# Altium schematic sheet power supply.SchDoc
size A3; SheetNumber: 1; SheetTotal: 2
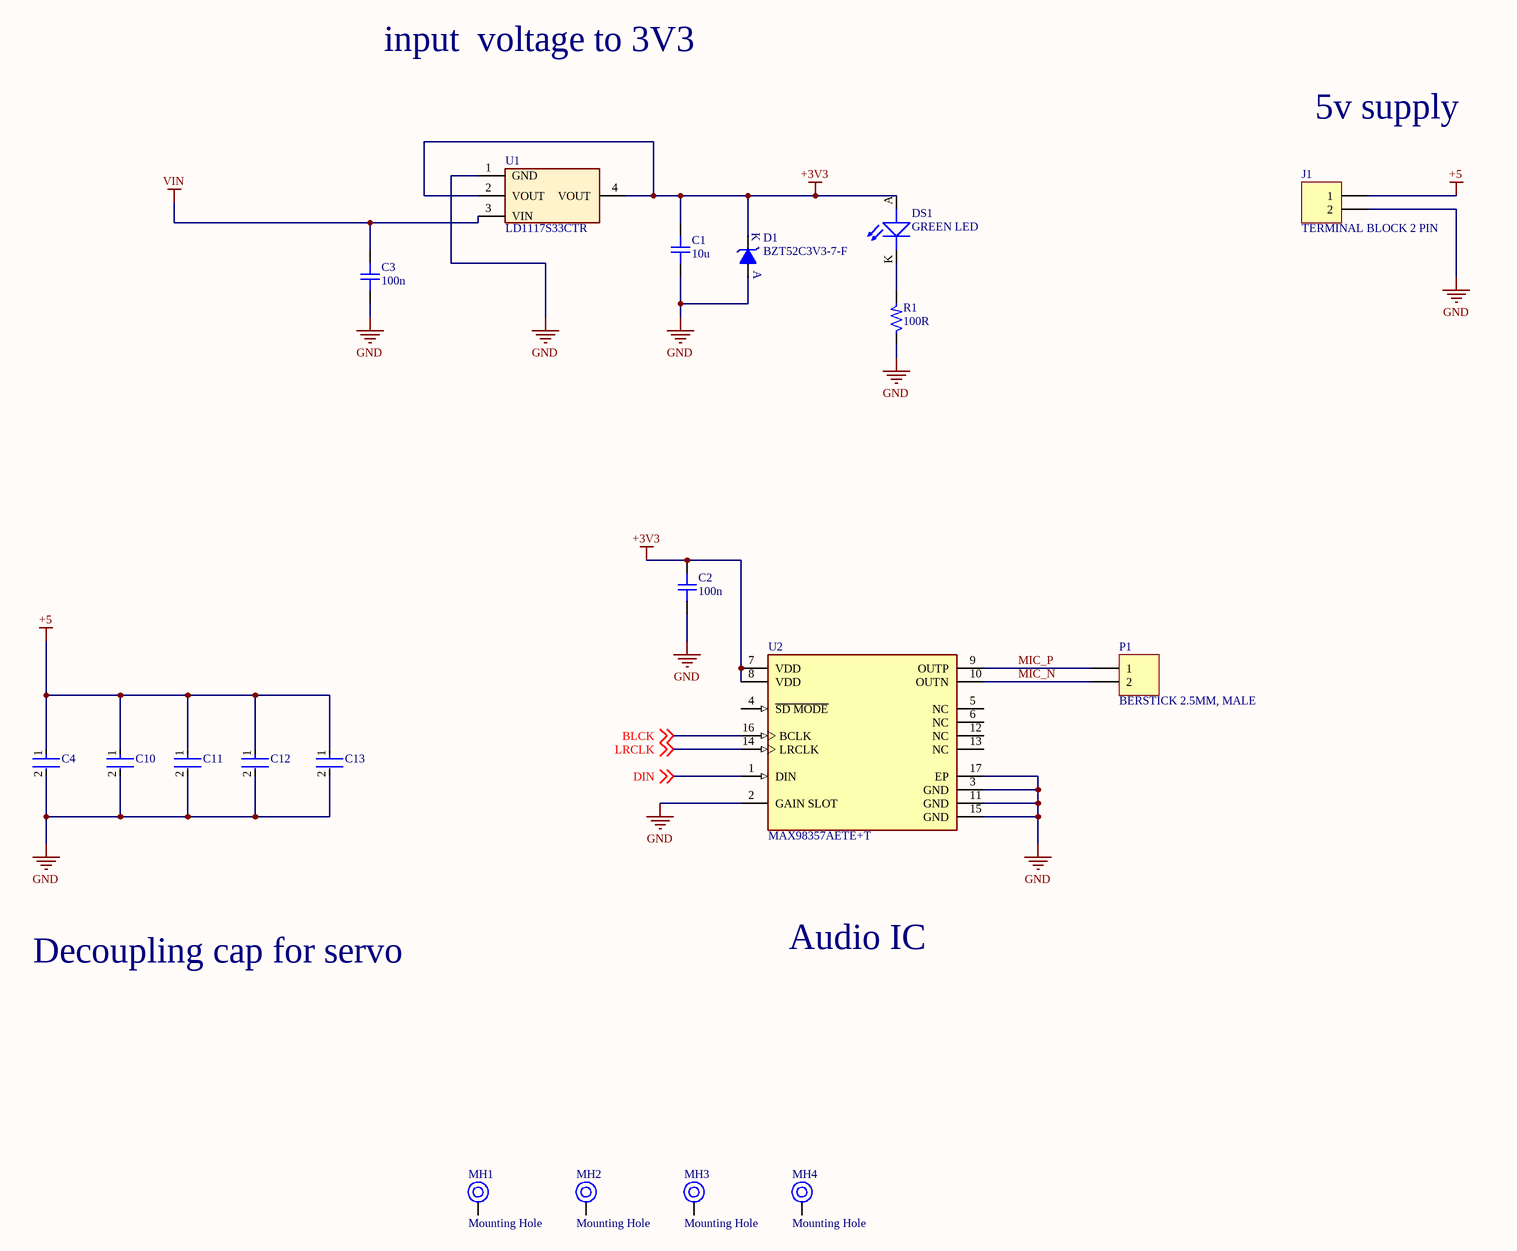
[diagram p0: power supply.SchDoc]

## Parts
C1  10u  [CAP_0603]
C2  100n  [CAP_0402]
C3  100n  [CAP_0402]
C4  C1210C107M9PACTU  [FP-C1210C107M9PACTU-MFG]  (value not drawn)
C10  C1210C107M9PACTU  [FP-C1210C107M9PACTU-MFG]  (value not drawn)
C11  C1210C107M9PACTU  [FP-C1210C107M9PACTU-MFG]  (value not drawn)
C12  C1210C107M9PACTU  [FP-C1210C107M9PACTU-MFG]  (value not drawn)
C13  C1210C107M9PACTU  [FP-C1210C107M9PACTU-MFG]  (value not drawn)
D1  BZT52C3V3-7-F  [DIO_SOD-123]
DS1  GREEN LED  [LED_0805]
J1  TERMINAL BLOCK 2 PIN  [CON2_P196_1729128_TH_ST]
MH1  Mounting Hole  [MOUNTING]
MH2  Mounting Hole  [MOUNTING]
MH3  Mounting Hole  [MOUNTING]
MH4  Mounting Hole  [MOUNTING]
P1  BERSTICK 2.5MM, MALE  [CON2_100_43D62_TH_ST]
R1  100R  [RES_0603]
U1  LD1117S33CTR  [SOT223_3]
U2  MAX98357AETE+T  [FP-T1633-4-MFG]

## Nets
+3V3: C1.2 C2.2 D1.K DS1.A(ANODE) U1.2(VOUT) U1.4(VOUT) U2.7(VDD) U2.8(VDD)
+5: C4.1 C10.1 C11.1 C12.1 C13.1 J1.1
GND: C1.1 C2.1 C3.1 C4.2 C10.2 C11.2 C12.2 C13.2 D1.A J1.2 R1.1 U1.1(GND) U2.2(GAIN_SLOT) U2.3(GND) U2.11(GND) U2.15(GND) U2.17(EP)
VIN: C3.2 U1.3(VIN)
BLCK: U2.16(BCLK) ; off-sheet BLCK
DIN: U2.1(DIN) ; off-sheet DIN
LRCLK: U2.14(LRCLK) ; off-sheet LRCLK
MIC_N: P1.2 U2.10(OUTN)
MIC_P: P1.1 U2.9(OUTP)
NetDS1_K: DS1.K(CATHODE) R1.2

Not connected (* = marked no-connect by the designer): MH1 1; MH2 1; MH3 1; MH4 1; U2 4(~{SD_MODE}) 5(NC) 6(NC) 12(NC) 13(NC)

## Notes on the sheet
- input  voltage to 3V3
- 5v supply
- Decoupling cap for servo
- Audio IC

## Library data of the parts
C1 = CAP_0603_10V: Capacitor SMD 0603 10V; Manufacturer: Samsung; Manufacturer Part Number: CL10A106KP8NNNC; LCSC: C19702
C2 C3 = CAP_0402_50V_1: Capacitor SMD 0402 50V; Manufacturer: Samsung; Manufacturer Part Number: CL05B104KO5NNNC; LCSC: C1525
C4 C10-C13 = CMP-2000-06018-2: CAP CER 100UF 6.3V X5R 1210; Dissipation Factor: 5%; Dielectric Material: Ceramic; Tolerance: 20%; Termination: SMD/SMT; REACH SVHC: No SVHC; Thickness: 0.11inch; Packaging: Tape and Reel; Series: C; Width: 2.5mm; Voltage Rating (DC): 6.3V; Voltage: 6.3V; Contact Plating: Tin; Package Quantity: 1; Case/Package: 1210; Min Operating Temperature: -55°C; Height: 2.5mm; Radiation Hardening: No; Capacitance: 100uF; Case Code (Metric): 3225; Depth: 2.5mm; Construction: Flat; Max Operating Temperature: 85°C; Number of Pins: 2; Mount: Surface Mount; Lead Free: Lead Free; RoHS Compliant: Yes; Voltage Rating: 6.3V; Dielectric: X5R; Length: 3.2mm; Case Code (Imperial): 1210
D1 = DIO-Z_3.3V-500mW-SOD123: Zener Diode 3.3V 500mW ±6% Surface Mount SOD-123; Manufacturer: Diodes Incorporated; Alternate Part Number-1: NA; Manufacturer Part Number: BZT52C3V3-7-F; Case/Package: SOD-123; Supplier-1: Digikey; Supplier Part Number-1: BZT52C3V3-FDICT-ND
DS1 = LED_GREEN-2.2-20mA-0805: Green 569nm LED Indication - Discrete 2.1V 0805 (2012 Metric); Manufacturer: Vishay Lite-On; Manufacturer Part Number: LTST-C171GKT; Alternate Part Number-1: NA; Case/Package: 0805; Supplier-1: SP ROAD; Supplier Part Number-1: LTST-C171GKT
J1 = CON-TB_2X1-196-ST-TH: 2 Pins, 1 Row 5mm Pitch, straight Connector, male; Manufacturer: Phoenix Contact; Manufacturer Part Number: MKDSN1,5/2; Alternate Part Number-1: NA; Case/Package: TH-CON; Supplier-1: SP ROAD; Supplier Part Number-1: MKDSN1,5/2
MH1-MH4 = MH_3.5H_6D: Manufacturer Part Number: NA; Case/Package: TH; Manufacturer: NA; Supplier-1: NA; Supplier Part Number-1: NA; Alternate Part Number-1: NA
P1 = CON-BS-PLG_2X1-100-ST-TH: 2 Pins, 1 Row 2.54mm Pitch, Straight bergstrip, Male; Manufacturer Part Number: NA; Manufacturer: Samtec; Case/Package: TH-CON; Supplier-1: SP ROAD; Supplier Part Number-1: NA; Alternate Part Number-1: NA
R1 = RES_100R-0.1W-1%-0603: 100 Ohms ±1% 0.1W, 1/10W Chip Resistor 0603 (1608 Metric) Thick Film; Manufacturer: Walsin; Manufacturer Part Number: WR06X1000FTL; Alternate Part Number-1: MR06X1000FTL; Case/Package: 0603; Supplier-1: SIRICOM; Supplier Part Number-1: WALSIN:WR06X1000FTL
U1 = REG_15V-3.3V-0.9A-12W-SOT223: Linear Voltage Regulator IC 1 Output 800mA SOT-223; Manufacturer: STMicroelectronics; Alternate Part Number-1: NA; Manufacturer Part Number: LD1117S33CTR; Case/Package: SOT223; Supplier-1: SP ROAD; Supplier Part Number-1: LD1117S33CTR
U2 = CMP-05698-000018-1: IC AMP CLASS D MONO 3.2W 16TQFN; Max Supply Voltage: 5.5V; Max Output Current: 1.6A; Voltage Gain: 15dB; Max Power Dissipation: 1.666W; Min Supply Voltage: 2.5V; Power Supply Rejection Ratio (PSRR): 77dB; Series: -; Contact Plating: Tin; Min Operating Temperature: -40°C; Packaging: Tape and Reel; Max Output Power: 3.2W; Mount: Surface Mount; Number of Pins: 16; RoHS Compliant: Yes; Max Operating Temperature: 85°C; Radiation Hardening: No